# EAGLE schematic automated_irrigating_system (EAGLE 9.4.1)

## Sheet 1 of 2
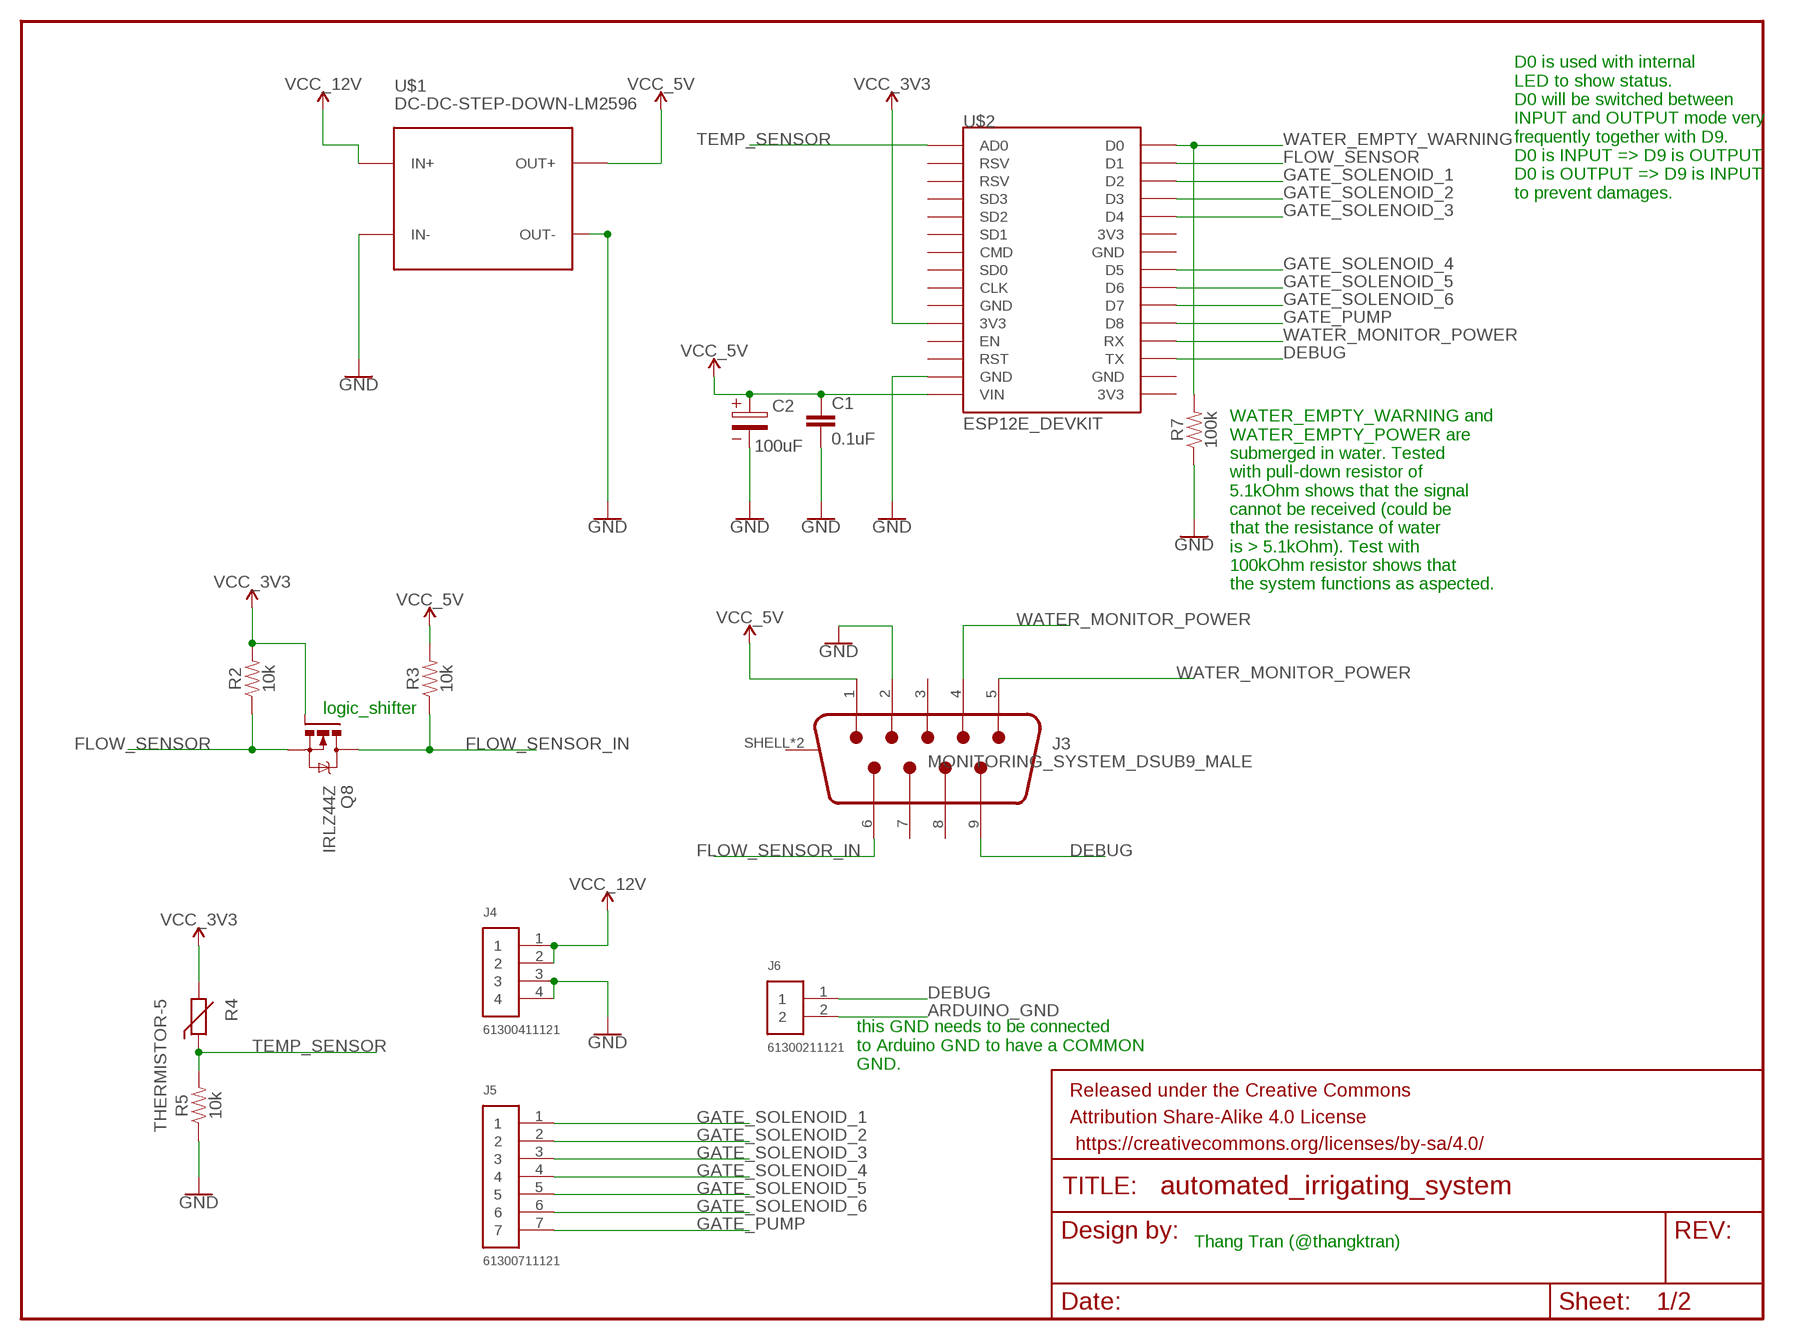
[diagram p0: schematic, sheet 1]

### Parts
C1  0.1uF  0.1UF-KIT-EZ-50V-20%  [CAP-PTH-SMALL-KIT]
C2  100uF  WCAP-PTHT_6,3X11_870135373001  [6.3X2.5X0.9(DXAXB)]
FRAME1  FRAME-LETTER  [CREATIVE_COMMONS]
J3  MONITORING_SYSTEM_DSUB9_MALE  618009211721  [618009211721]
J4  61300411121  [61300411121]
J5  61300711121  [61300711121]
J6  61300211121  [61300211121]
Q8  IRLZ44Z  [TO220BH]
R2  10k  10KOHM-HORIZ-1/4W-1%  [AXIAL-0.3]
R3  10k  10KOHM-HORIZ-1/4W-1%  [AXIAL-0.3]
R4  THERMISTOR-5  [R-5]
R5  10k  10KOHM-HORIZ-1/4W-1%  [AXIAL-0.3]
R7  100k  100KOHM-HORIZ-1/4W-1%  [AXIAL-0.3]
U$1  DC-DC-STEP-DOWN-LM2596  [DC-DC-STEP-DOWN-LM2596]
U$2  ESP12E_DEVKIT  [ESP12E_DEVKIT]

### Nets
ARDUINO_GND: J6.2
DEBUG: J3.9 J6.1 U$2.TX
FLOW_SENSOR: Q8.S R2.P$1 U$2.D1
FLOW_SENSOR_IN: J3.6 Q8.D R3.P$1
GATE_PUMP: J5.7 U$2.D8 ; also sheet 2
GATE_SOLENOID_1: J5.1 U$2.D2 ; also sheet 2
GATE_SOLENOID_2: J5.2 U$2.D3 ; also sheet 2
GATE_SOLENOID_3: J5.3 U$2.D4 ; also sheet 2
GATE_SOLENOID_4: J5.4 U$2.D5 ; also sheet 2
GATE_SOLENOID_5: J5.5 U$2.D6 ; also sheet 2
GATE_SOLENOID_6: J5.6 U$2.D7 ; also sheet 2
GND: C1.2 C2.2 J3.2 J4.3 J4.4 R5.P$1 R7.P$1 U$1.IN- U$1.OUT- U$2.GND@1(GND) ; also sheet 2
TEMP_SENSOR: R4.1 R5.P$2 U$2.AD0
VCC: Q8.G R2.P$2 R4.2 U$2.3V3@0(3V3) ; supply symbol labelled VCC_3V3
VCC_1: J4.1 J4.2 U$1.IN+ ; supply symbol labelled VCC_12V ; also sheet 2
VCC_2: C1.1 C2.1 J3.1 R3.P$2 U$1.OUT+ U$2.VIN ; supply symbol labelled VCC_5V
WATER_EMPTY_WARNING: R7.P$2 U$2.D0
WATER_MONITOR_POWER: J3.4 J3.5 U$2.RX
Unconnected: J3.3 J3.7 J3.8 J3.SHELL1(SHIELD) J3.SHELL(SHIELD) U$2.3V3@1(3V3) U$2.3V3@2(3V3) U$2.CLK U$2.CMD U$2.EN U$2.GND@0(GND) U$2.GND@2(GND) U$2.GND@3(GND) U$2.RST U$2.RSV@0(RSV) U$2.RSV@1(RSV) U$2.SD0 U$2.SD1 U$2.SD2 U$2.SD3

### Notes on the sheet
- D0 is used with internal
  LED to show status.
  D0 will be switched between
  INPUT and OUTPUT mode very
  frequently together with D9.
  D0 is INPUT => D9 is OUTPUT
  D0 is OUTPUT => D9 is INPUT
  to prevent damages.
- WATER_EMPTY_WARNING and
  WATER_EMPTY_POWER are
  submerged in water. Tested
  with pull-down resistor of
  5.1kOhm shows that the signal
  cannot be received (could be
  that the resistance of water
  is > 5.1kOhm). Test with
  100kOhm resistor shows that
  the system functions as aspected.
- logic_shifter
- this GND needs to be connected
  to Arduino GND to have a COMMON
  GND.
- Thang Tran (@thangktran)

## Sheet 2 of 2
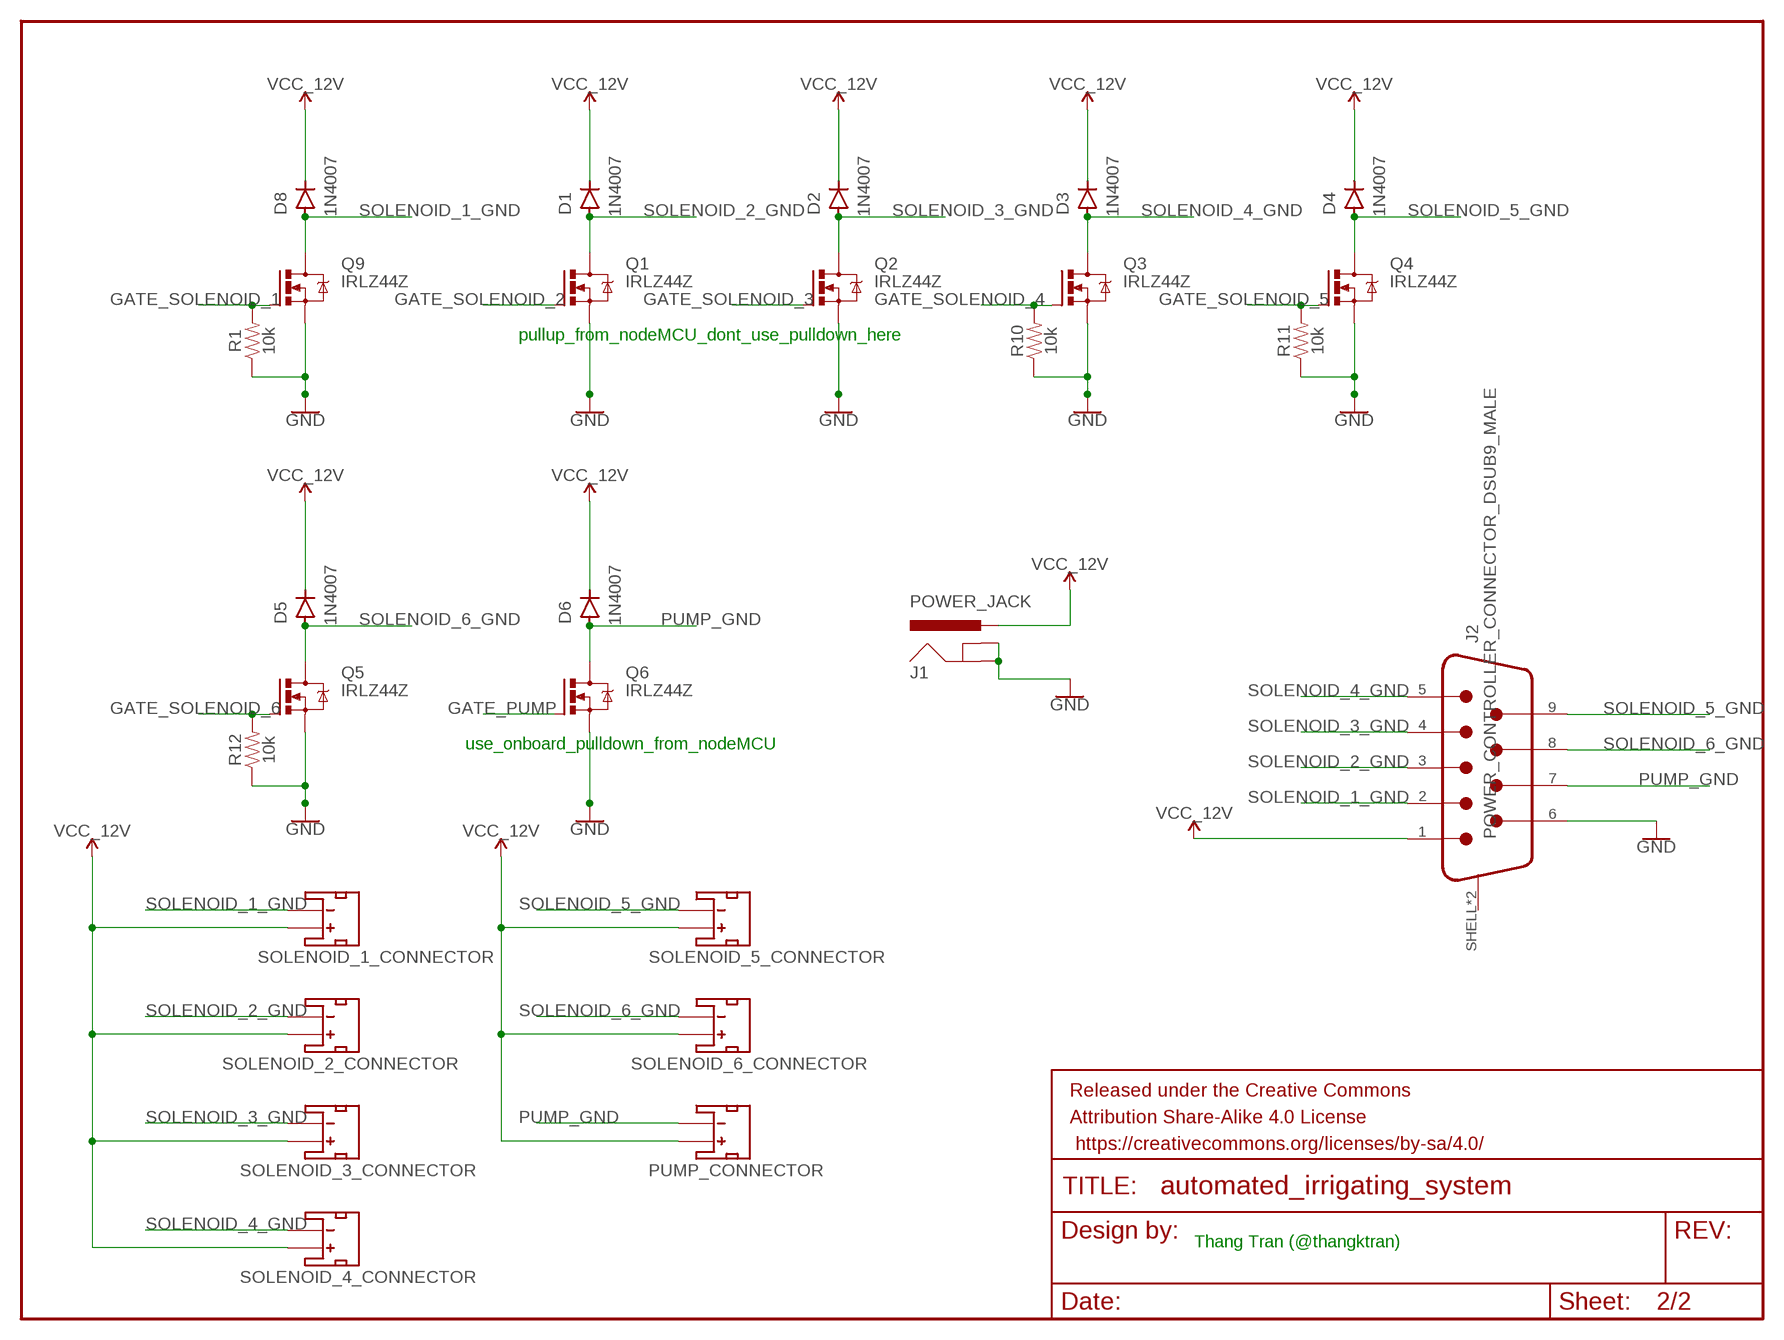
[diagram p1: schematic, sheet 2]

### Parts
D1  1N4007  [DO-41]
D2  1N4007  [DO-41]
D3  1N4007  [DO-41]
D4  1N4007  [DO-41]
D5  1N4007  [DO-41]
D6  1N4007  [DO-41]
D8  1N4007  [DO-41]
FRAME2  FRAME-LETTER  [CREATIVE_COMMONS]
J1  POWER_JACK  [POWER_JACK_PTH]
J2  POWER_CONTROLLER_CONNECTOR_DSUB9_MALE  618009211721  [618009211721]
PUMP_CONNECTOR  JST_FEMALE  JST_2MM_MALE  [JST-2-SMD]
Q1  IRLZ44Z  [TO220BH]
Q2  IRLZ44Z  [TO220BH]
Q3  IRLZ44Z  [TO220BH]
Q4  IRLZ44Z  [TO220BH]
Q5  IRLZ44Z  [TO220BH]
Q6  IRLZ44Z  [TO220BH]
Q9  IRLZ44Z  [TO220BH]
R1  10k  10KOHM-HORIZ-1/4W-1%  [AXIAL-0.3]
R10  10k  10KOHM-HORIZ-1/4W-1%  [AXIAL-0.3]
R11  10k  10KOHM-HORIZ-1/4W-1%  [AXIAL-0.3]
R12  10k  10KOHM-HORIZ-1/4W-1%  [AXIAL-0.3]
SOLENOID_1_CONNECTOR  JST_FEMALE  JST_2MM_MALE  [JST-2-SMD]
SOLENOID_2_CONNECTOR  JST_FEMALE  JST_2MM_MALE  [JST-2-SMD]
SOLENOID_3_CONNECTOR  JST_FEMALE  JST_2MM_MALE  [JST-2-SMD]
SOLENOID_4_CONNECTOR  JST_FEMALE  JST_2MM_MALE  [JST-2-SMD]
SOLENOID_5_CONNECTOR  JST_FEMALE  JST_2MM_MALE  [JST-2-SMD]
SOLENOID_6_CONNECTOR  JST_FEMALE  JST_2MM_MALE  [JST-2-SMD]

### Nets
GATE_PUMP: Q6.G ; also sheet 1
GATE_SOLENOID_1: Q9.G R1.P$2 ; also sheet 1
GATE_SOLENOID_2: Q1.G ; also sheet 1
GATE_SOLENOID_3: Q2.G ; also sheet 1
GATE_SOLENOID_4: Q3.G R10.P$2 ; also sheet 1
GATE_SOLENOID_5: Q4.G R11.P$2 ; also sheet 1
GATE_SOLENOID_6: Q5.G R12.P$2 ; also sheet 1
GND: J1.GND J1.GNDBREAK J2.6 Q1.S Q2.S Q3.S Q4.S Q5.S Q6.S Q9.S R1.P$1 R10.P$1 R11.P$1 R12.P$1 ; also sheet 1
PUMP_GND: D6.A J2.7 PUMP_CONNECTOR.1(-) Q6.D
SOLENOID_1_GND: D8.A J2.2 Q9.D SOLENOID_1_CONNECTOR.1(-)
SOLENOID_2_GND: D1.A J2.3 Q1.D SOLENOID_2_CONNECTOR.1(-)
SOLENOID_3_GND: D2.A J2.4 Q2.D SOLENOID_3_CONNECTOR.1(-)
SOLENOID_4_GND: D3.A J2.5 Q3.D SOLENOID_4_CONNECTOR.1(-)
SOLENOID_5_GND: D4.A J2.9 Q4.D SOLENOID_5_CONNECTOR.1(-)
SOLENOID_6_GND: D5.A J2.8 Q5.D SOLENOID_6_CONNECTOR.1(-)
VCC_1: D1.C D2.C D3.C D4.C D5.C D6.C D8.C J1.PWR J2.1 PUMP_CONNECTOR.2(+) SOLENOID_1_CONNECTOR.2(+) SOLENOID_2_CONNECTOR.2(+) SOLENOID_3_CONNECTOR.2(+) SOLENOID_4_CONNECTOR.2(+) SOLENOID_5_CONNECTOR.2(+) SOLENOID_6_CONNECTOR.2(+) ; supply symbol labelled VCC_12V ; also sheet 1
Unconnected: J2.SHELL1(SHIELD) J2.SHELL(SHIELD) PUMP_CONNECTOR.NC1(PAD1) PUMP_CONNECTOR.NC2(PAD2) SOLENOID_1_CONNECTOR.NC1(PAD1) SOLENOID_1_CONNECTOR.NC2(PAD2) SOLENOID_2_CONNECTOR.NC1(PAD1) SOLENOID_2_CONNECTOR.NC2(PAD2) SOLENOID_3_CONNECTOR.NC1(PAD1) SOLENOID_3_CONNECTOR.NC2(PAD2) SOLENOID_4_CONNECTOR.NC1(PAD1) SOLENOID_4_CONNECTOR.NC2(PAD2) SOLENOID_5_CONNECTOR.NC1(PAD1) SOLENOID_5_CONNECTOR.NC2(PAD2) SOLENOID_6_CONNECTOR.NC1(PAD1) SOLENOID_6_CONNECTOR.NC2(PAD2)

### Notes on the sheet
- pullup_from_nodeMCU_dont_use_pulldown_here
- use_onboard_pulldown_from_nodeMCU
- Thang Tran (@thangktran)

## Library data of the parts
C1 = SparkFun-Capacitors:0.1UF: 0.1µF ceramic capacitors A capacitor is a passive two-terminal electrical component used to store electrical energy temporarily in an electric field.; PROD_ID: CAP-08370
C2 = Wurth_Elektronik_Passive_Capacitors_rev18b:WCAP-PTHT: WCAP-PTHT Aluminum Polymer Capacitors Characteristics Aluminum Polymer Capacitor Recommended soldering: Wave Operating temperature: -55°C to +125°C +125°C product series Low ESR at high frequency range Long life: 2000h @ +125°C Package name and Variant abbreviation: Package: D X A X B = Diameter of the outline X Pitch of the hole X Diameter of the hole. <http://katalog.we-online.de/media/images/eisos/WCAP-PTHT_pf2.jpg> Details see: http://katalog.we-online.de/en/pbs/WCAP-PTHT/ Created: 2015-02-06 2015 (C) Wurth Elektronik; WE-NUMBER: 870135373001/100uF
D1-D6 D8 = Diodes:1N4007: DIODE GEN PURP 1KV 1A DO41 Manufacturer's datasheet <https://www.mccsemi.com/pdf/Products/1N4001-1N4007(DO-41).pdf>; CREATED_BY: PCBLayout.com; DIGIKEY_PART_NUMBER: 1N4007MSCT-ND; MANUFACTURER: Micro Commercial Co; MPN: 1N4007; PACKAGE: DO-41
FRAME1 FRAME2 = SparkFun-Aesthetics:FRAME-LETTER: Schematic Frame - Letter Standard 8.5x11 US Letter frame
J1 = SparkFun-Connectors:POWER_JACK: Power Jack Connector This is the standard 5.5mm barrel jack for power. The PTH is the most common, proven, reliable, footprint. The Slot footprint only works if the mill layer is transmitted to the PCB fab house so be warned. Here are the connectors we sell at SparkFun: DC Barrel Power Jack/Connector <https://www.sparkfun.com/products/119> (PRT-00119) DC Barrel Power Jack/Connector (SMD) <https://www.sparkfun.com/products/12748> (PRT-12748) DC Barrel Jack Adapter - Breadboard Compatible <https://www.sparkfun.com/products/10811> (PRT-10811) It is used on this SparkFun product (and many, many others): SparkFun RedBoard - Programmed with Arduino <https://www.sparkfun.com/products/12757> (DEV-12757) Also, if you need a mating power supply or connector, please check these out: Wall Adapter Power Supply - 9VDC 650mA <https://www.sparkfun.com/products/298> (TOL-00298) DC Barrel Jack Adapter - Male <https://www.sparkfun.com/products/10287> (PRT-10287); PROD_ID: CONN-08197
J2 J3 = Wurth_Elektronik_Electromechanic_Input-Output_Connectors_rev19a:618009211721: WR-DSUB 8.08mm Male Angled PCB Connector without Hex Screw, 9 pins=>Code : Con_I-O_DSUB_PCB_Male_wo-screw_618009211721 <http://katalog.we-online.de/media/images/eican/Con_I-O_DSUB_PCB_Male_wo-screw_6180xx211721_pf2.jpg> Details see: http://katalog.we-online.de/en/em/DSUB_MALE_ANGLED_PCB_CONNECTOR_W_O_HEX_SCREW_8_08MM_6180XX211721 Created 2014-07-10, Karrer Zheng 2014 (C) Würth Elektronik
J4 = Headers:61300411121: CONN HEADER VERT 4POS 2.54MM Manufacturer's datasheet <https://katalog.we-online.de/em/datasheet/6130xx11121.pdf>; CREATED_BY: PCBLayout.com; DIGI_KEY_PART_NUMBER: 732-5317-ND; MANUFACTURER: Wurth Electronics Inc.; MPN: 61300411121
J5 = Headers:61300711121: CONN HEADER VERT 7POS 2.54MM Manufacturer's datasheet <https://katalog.we-online.de/em/datasheet/6130xx11121.pdf>; CREATED_BY: PCBLayout.com; DIGI_KEY_PART_NUMBER: 732-5320-ND; MANUFACTURER: Wurth Electronics Inc.; MPN: 61300711121
J6 = Headers:61300211121: CONN HEADER VERT 2POS 2.54MM Manufacturer's datasheet <https://katalog.we-online.de/em/datasheet/6130xx11121.pdf>; CREATED_BY: PCBLayout.com; DIGI_KEY_PART_NUMBER: 732-5315-ND; MANUFACTURER: Wurth Electronics Inc.; MPN: 61300211121
PUMP_CONNECTOR SOLENOID_1_CONNECTOR SOLENOID_2_CONNECTOR SOLENOID_3_CONNECTOR SOLENOID_4_CONNECTOR SOLENOID_5_CONNECTOR SOLENOID_6_CONNECTOR = SparkFun-Connectors:JST_2MM_MALE: JST 2MM MALE RA CONNECTOR Two pin, compact surface mount connector. Commonly used as a battery input connection point. We really like the solid locking feeling and high current rating on these small connectors. We use these all the time as battery connectors. Mates to single-cell LiPo batteries. Here is the connector we sell at SparkFun: JST Right Angle Connector - White <https://www.sparkfun.com/products/8612> (PRT-08612) Datasheet <http://www.sparkfun.com/datasheets/Prototyping/Connectors/JST-Horizontal.pdf> It was used on these SparkFun products: SparkFun MOSFET Power Controller <https://www.sparkfun.com/products/11214> (PRT-11214) SparkFun Battery Babysitter - LiPo Battery Manager <https://www.sparkfun.com/products/13777> (PRT-13777) And many, many others that required a lipo battery connection.; PROD_ID: CONN-11443; SF_ID: PRT-08612
Q1-Q6 Q8 Q9 = transistor-power:IRLZ44Z: N-Channel HEXFET® Power MOSFET Logic Level AUTOMOTIVE MOSFET Source: http://www.irf.com/product-info/datasheets/data/irlz44zpbf.pdf
R1-R3 R5 R10-R12 = SparkFun-Resistors:10KOHM: 10kΩ resistor A resistor is a passive two-terminal electrical component that implements electrical resistance as a circuit element. Resistors act to reduce current flow, and, at the same time, act to lower voltage levels within circuits. - Wikipedia; PROD_ID: RES-12183
R4 = varistor:THERMISTOR: THERMISTOR
R7 = SparkFun-Resistors:100KOHM: 100kΩ resistor A resistor is a passive two-terminal electrical component that implements electrical resistance as a circuit element. Resistors act to reduce current flow, and, at the same time, act to lower voltage levels within circuits. - Wikipedia; PROD_ID: RES-12184
U$1 = LM2596S_step_down:DC-DC-STEP-DOWN-LM2596: DC/DC Step-Down Regulator based on LM2596-ADJ chip LM2596 datasheet available here: http://www.ti.com/lit/ds/symlink/lm2596.pdf Click here to find device on ebay.com <http://www.ebay.com/sch/lm2596+power+regulator>
U$2 = ESP12E_DEVKIT:ESP12E_DEVKIT: ESP12E DEVKIT BOARD